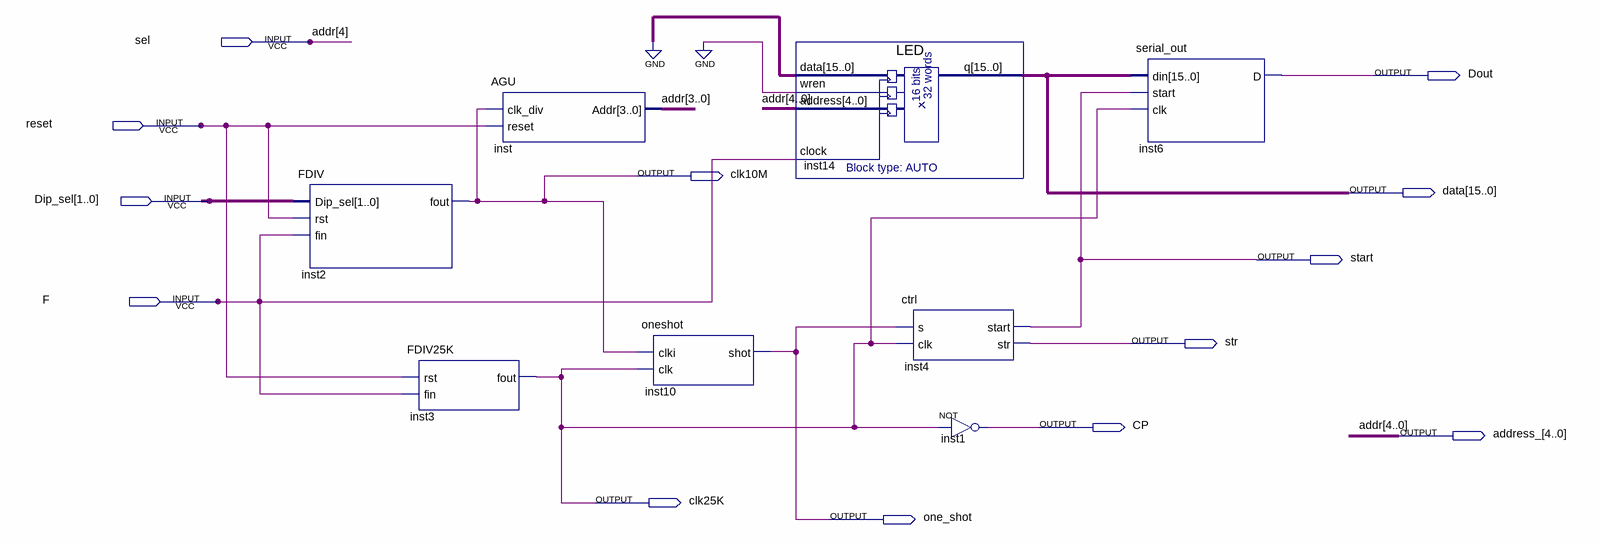
[diagram p0: schematic sheet]
// Quartus schematic hw4n.bdf as structural Verilog: 8 symbols, 13 pins
module hw4n (
  input  sel,
  input  reset,
  input  [1:0] Dip_sel,
  input  F,
  output Dout,
  output clk10M,
  output [15:0] data,
  output start,
  output str,
  output CP,
  output [4:0] address_,
  output clk25K,
  output one_shot
);

  FDIV inst2 (.Dip_sel(Dip_sel), .rst(reset), .fin(F), .fout(clk10M));
  FDIV25K inst3 (.rst(reset), .fin(F), .fout(clk25K));
  AGU inst (.clk_div(clk10M), .reset(reset), .Addr(address_[3:0]));
  oneshot inst10 (.clki(clk10M), .clk(clk25K), .shot(one_shot));
  LED inst14 (.data({16{1'b0}}), .wren(1'b0), .address({sel, address_[3:0]}), .clock(F), .q(data));
  ctrl inst4 (.s(one_shot), .clk(clk25K), .start(start), .str(str));
  not inst1 (CP, clk25K);
  serial_out inst6 (.din(data), .start(start), .clk(clk25K), .D(Dout));

  assign address_[4] = sel;

  // Other names for the same wires on the sheet: addr[4:0] = {sel, address_[3:0]}
endmodule
